# Altium schematic sheet main.SchDoc
size A4; SheetNumber: 1; SheetTotal: 2
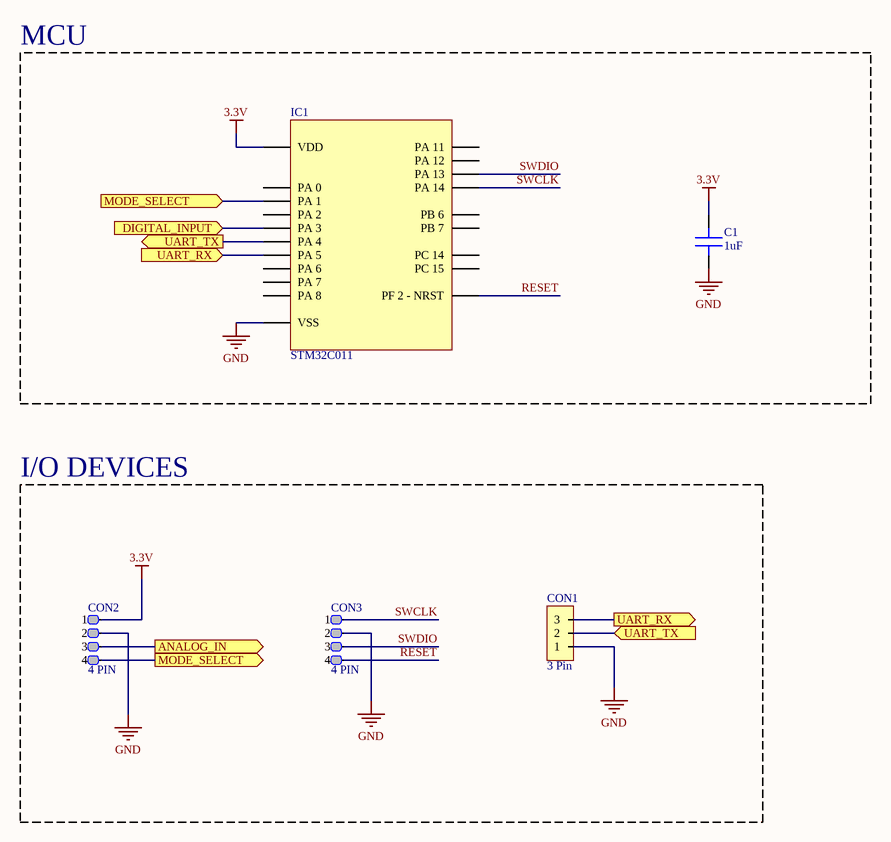
[diagram p0: main.SchDoc]

## Parts
C1  1uF  [C 0603]
CON1  3 Pin  [Goldpin 2.54 3P]
CON2  4 PIN  [Goldpin 2.54 4P]
CON3  4 PIN  [BM04B-SRSS-TB]
IC1  STM32C011  [20-UFQFPN]

## Blocks framed on the sheet
MCU: C1 IC1
I/O DEVICES: CON1-CON3

## Ports
ANALOG_IN (out), DIGITAL_INPUT (in), MODE_SELECT (in), MODE_SELECT (out), UART_RX (in), UART_RX (out), UART_TX (in), UART_TX (out)

## Nets
3.3V: C1.1 CON2.1 IC1.2(VDD)
GND: C1.2 CON1.1 CON2.2 CON3.2 IC1.3(VSS)
ANALOG_IN: CON2.3 ; port ANALOG_IN
DIGITAL_INPUT: IC1.8(PA_3) ; port DIGITAL_INPUT
MODE_SELECT: CON2.4 IC1.6(PA_1) ; port MODE_SELECT
RESET: CON3.4 IC1.4(PF_2_-_NRST)
SWCLK: CON3.1 IC1.17(PA_14)
SWDIO: CON3.3 IC1.16(PA_13)
UART_RX: CON1.3 IC1.10(PA_5) ; port UART_RX
UART_TX: CON1.2 IC1.9(PA_4) ; port UART_TX

Not connected (* = marked no-connect by the designer): IC1 1(PC_15) 5(PA_0) 7(PA_2) 11(PA_6) 12(PA_7) 13(PA_8) 14(PA_11) 15(PA_12) 18(PB_6) 19(PB_7) 20(PC_14)

## Library data of the parts
C1 = Capacitor: MLCC Capacitor
IC1 = STM32C011F4U: UFQFPN 20